# EAGLE design can_hub2 (EAGLE 9.6.2)
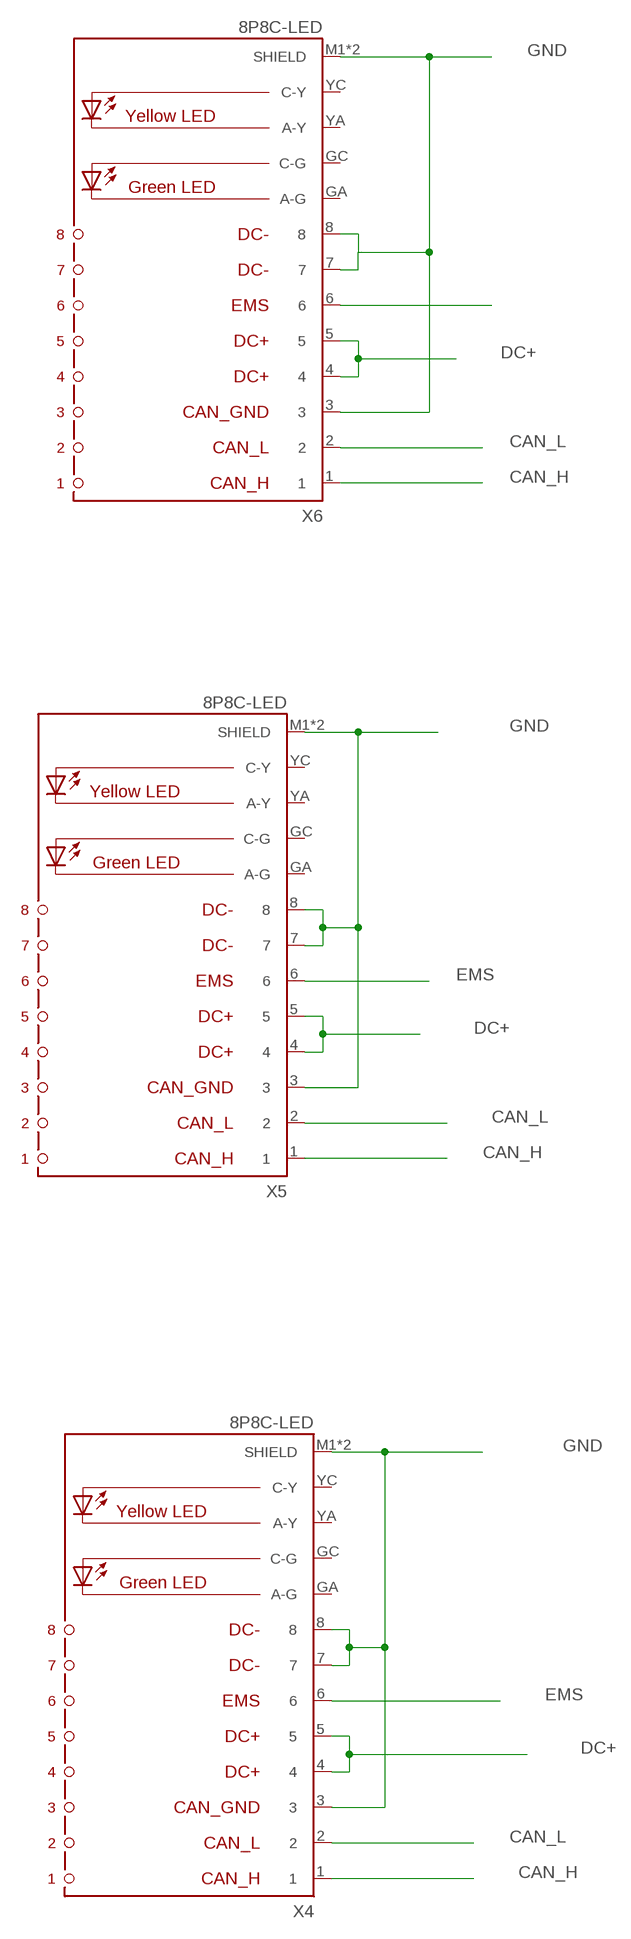
[diagram p0: schematic, sheet 1, part 1 of 3]
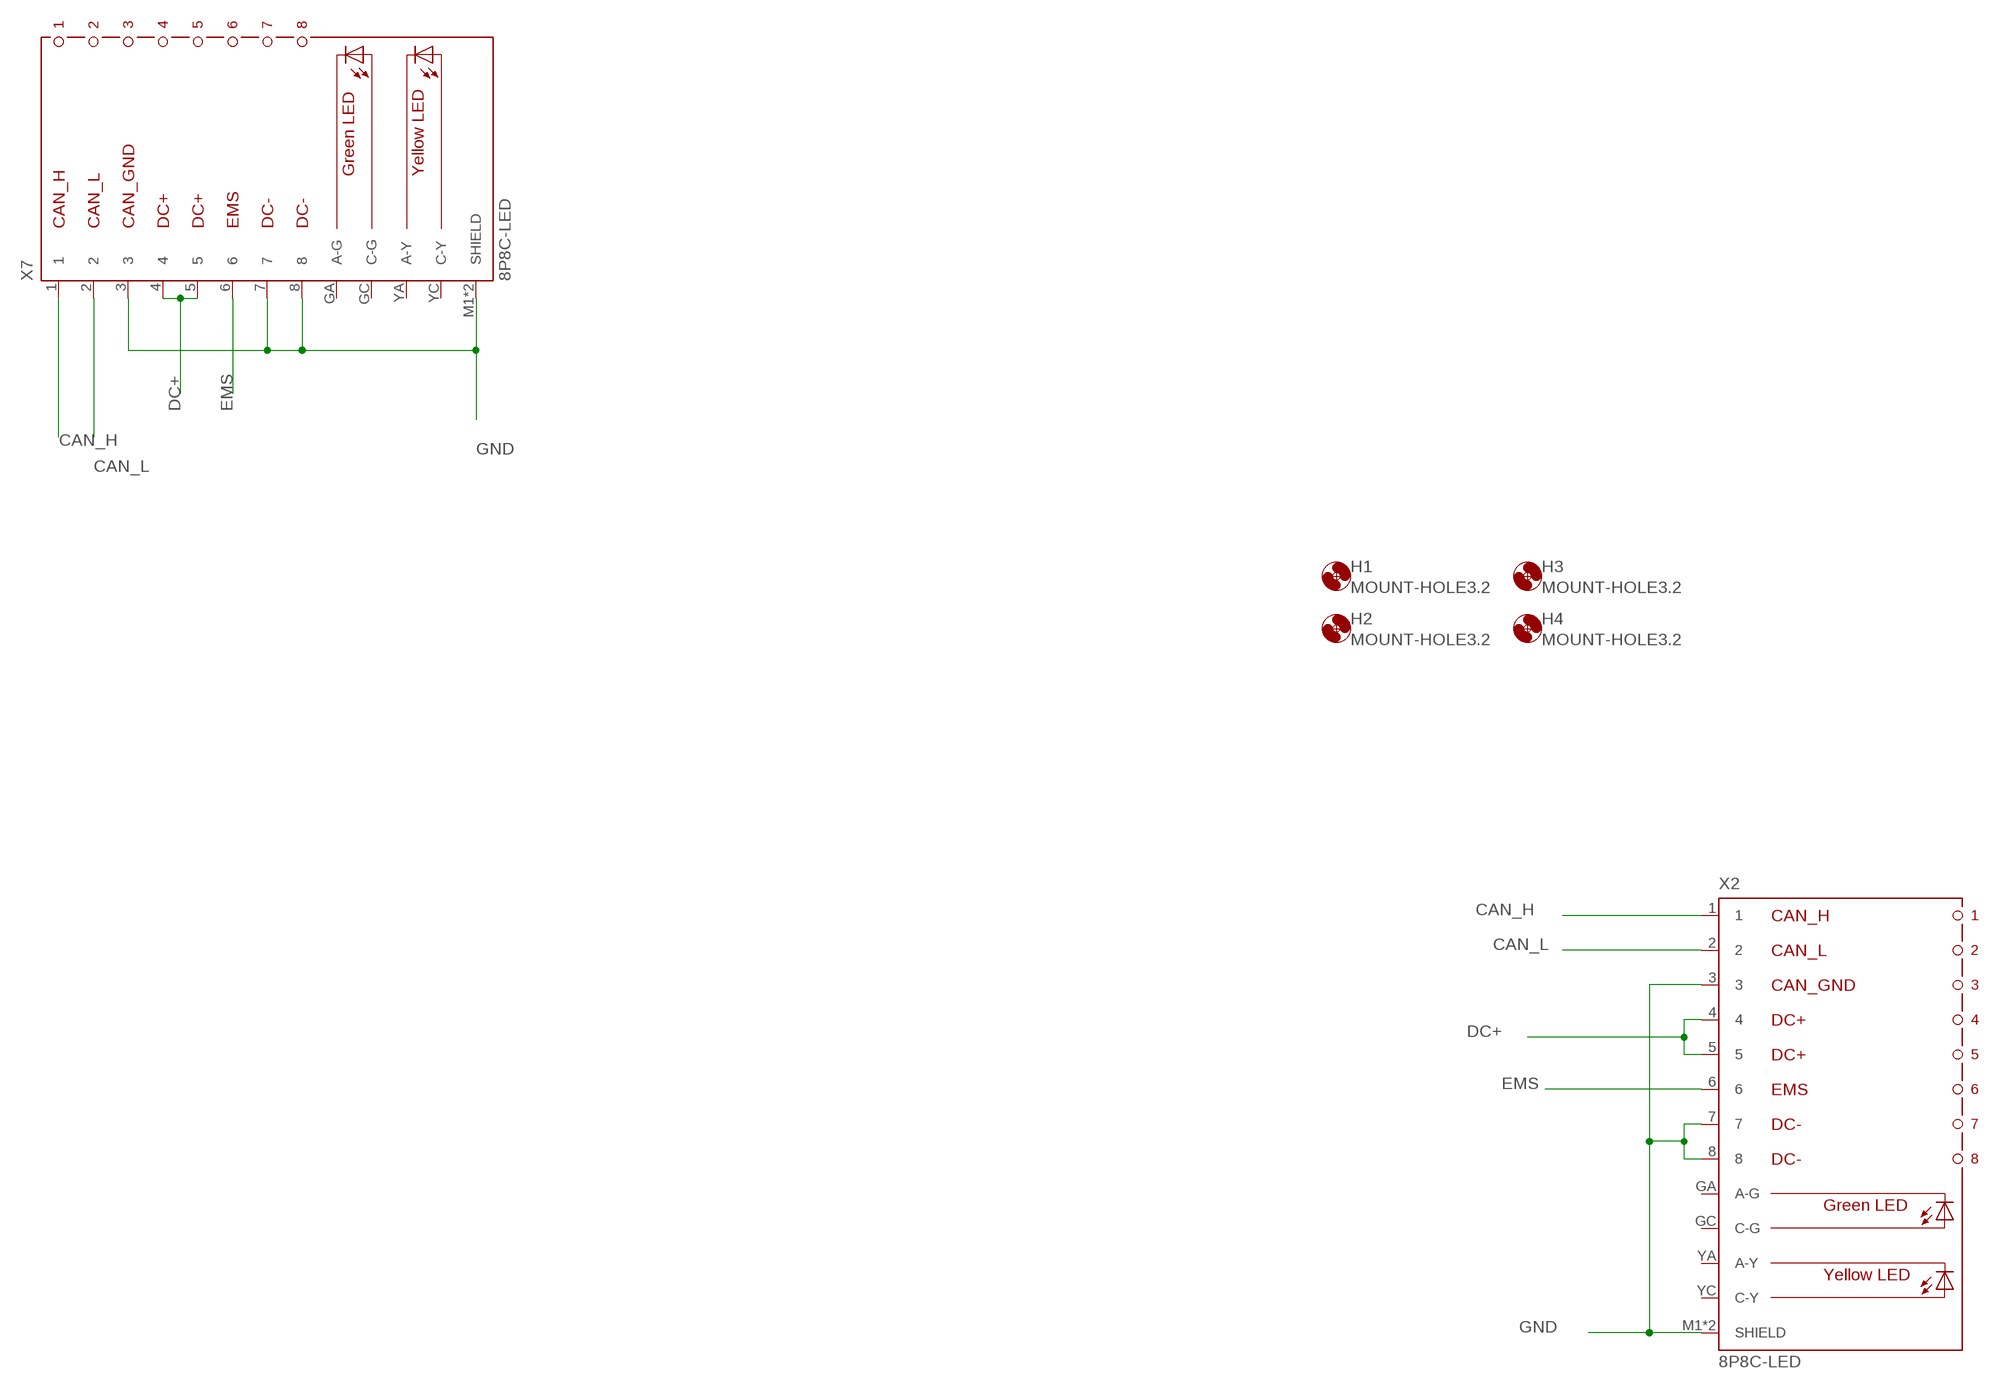
[diagram p1: schematic, sheet 1, part 2 of 3]
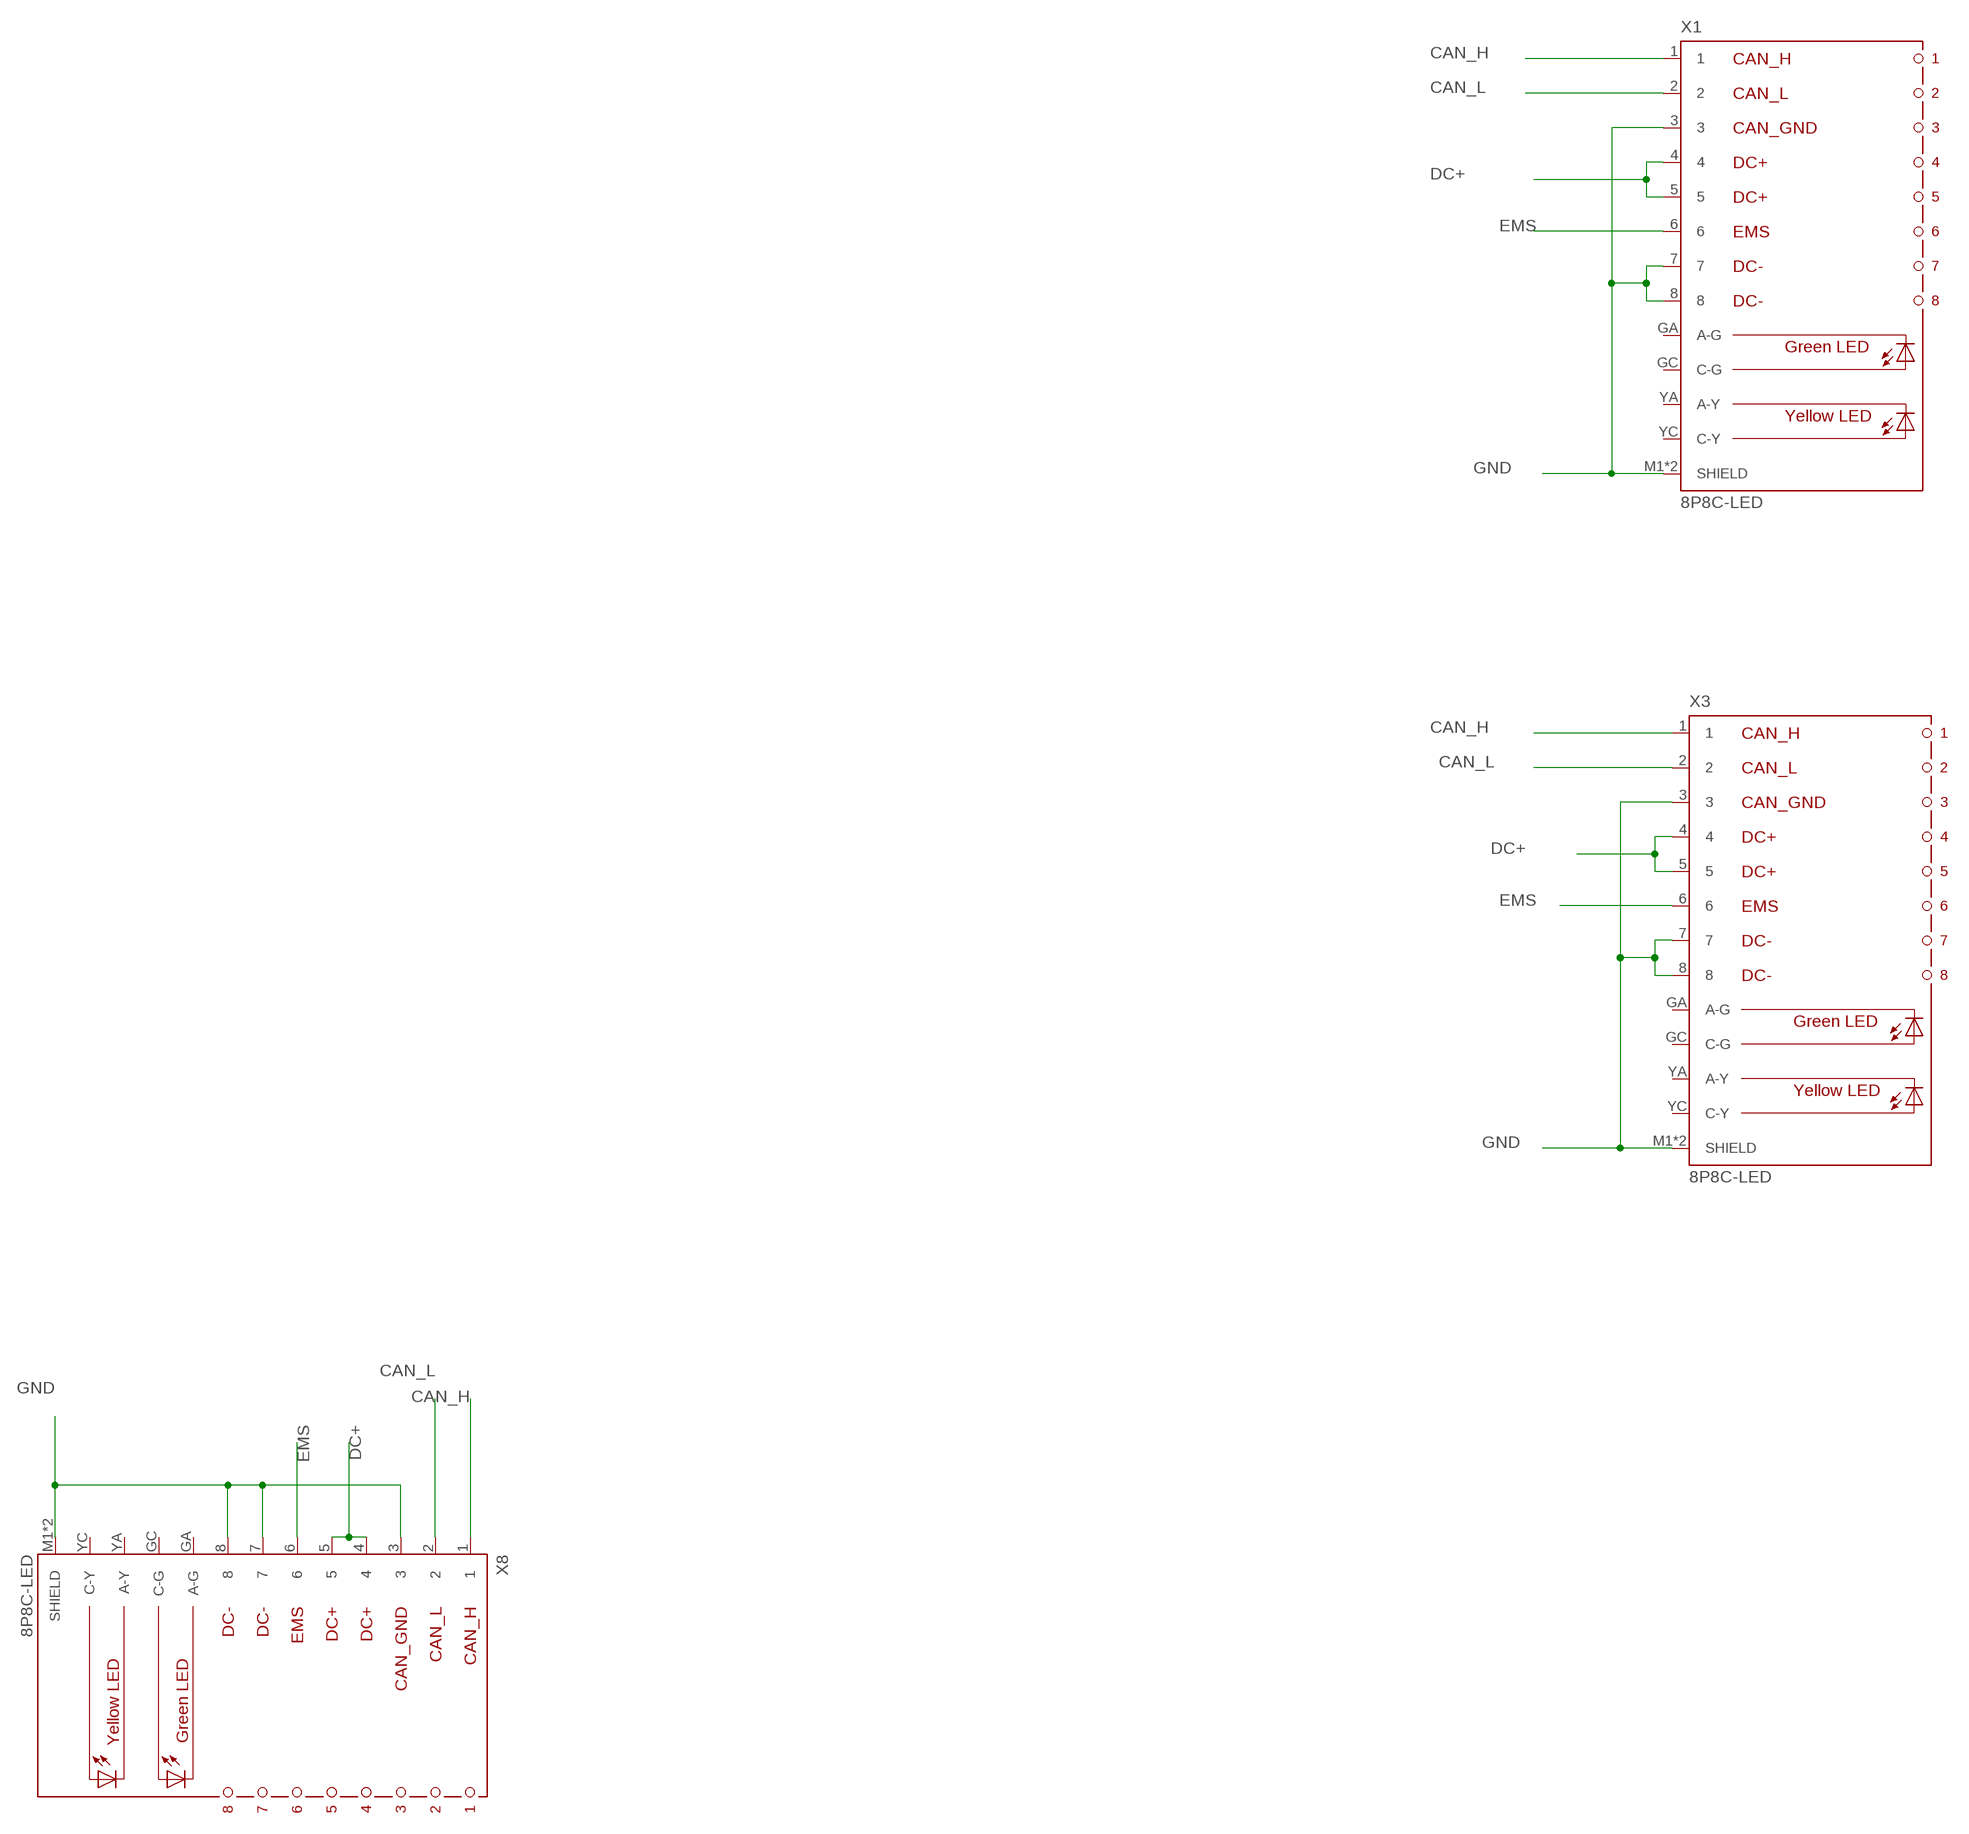
[diagram p2: schematic, sheet 1, part 3 of 3]

## Parts
H1  MOUNT-HOLE3.2  [3,2]
H2  MOUNT-HOLE3.2  [3,2]
H3  MOUNT-HOLE3.2  [3,2]
H4  MOUNT-HOLE3.2  [3,2]
X1  8P8C-LED  [8P8C-LED]
X2  8P8C-LED  [8P8C-LED]
X3  8P8C-LED  [8P8C-LED]
X4  8P8C-LED  [8P8C-LED]
X5  8P8C-LED  [8P8C-LED]
X6  8P8C-LED  [8P8C-LED]
X7  8P8C-LED  [8P8C-LED]
X8  8P8C-LED  [8P8C-LED]

## Nets
CAN_H: X1.1 X2.1 X3.1 X4.1 X5.1 X6.1 X7.1 X8.1
CAN_L: X1.2 X2.2 X3.2 X4.2 X5.2 X6.2 X7.2 X8.2
DC+: X1.4 X1.5 X2.4 X2.5 X3.4 X3.5 X4.4 X4.5 X5.4 X5.5 X6.4 X6.5 X7.4 X7.5 X8.4 X8.5
EMS: X1.6 X2.6 X3.6 X4.6 X5.6 X6.6 X7.6 X8.6
GND: X1.3 X1.7 X1.8 X1.M1(SHIELD) X1.M2(SHIELD) X2.3 X2.7 X2.8 X2.M1(SHIELD) X2.M2(SHIELD) X3.3 X3.7 X3.8 X3.M1(SHIELD) X3.M2(SHIELD) X4.3 X4.7 X4.8 X4.M1(SHIELD) X4.M2(SHIELD) X5.3 X5.7 X5.8 X5.M1(SHIELD) X5.M2(SHIELD) X6.3 X6.7 X6.8 X6.M1(SHIELD) X6.M2(SHIELD) X7.3 X7.7 X7.8 X7.M1(SHIELD) X7.M2(SHIELD) X8.3 X8.7 X8.8 X8.M1(SHIELD) X8.M2(SHIELD)
Unconnected: X1.GA(A-G) X1.GC(C-G) X1.YA(A-Y) X1.YC(C-Y) X2.GA(A-G) X2.GC(C-G) X2.YA(A-Y) X2.YC(C-Y) X3.GA(A-G) X3.GC(C-G) X3.YA(A-Y) X3.YC(C-Y) X4.GA(A-G) X4.GC(C-G) X4.YA(A-Y) X4.YC(C-Y) X5.GA(A-G) X5.GC(C-G) X5.YA(A-Y) X5.YC(C-Y) X6.GA(A-G) X6.GC(C-G) X6.YA(A-Y) X6.YC(C-Y) X7.GA(A-G) X7.GC(C-G) X7.YA(A-Y) X7.YC(C-Y) X8.GA(A-G) X8.GC(C-G) X8.YA(A-Y) X8.YC(C-Y)

## Library data of the parts
H1-H4 = holes:MOUNT-HOLE: MOUNTING HOLE with drill center marker
X1-X8 = con-rj45:8P8C-LED: generic 8P8C connector with two LED's; OC_FARNELL: unknown; OC_NEWARK: unknown

## Board
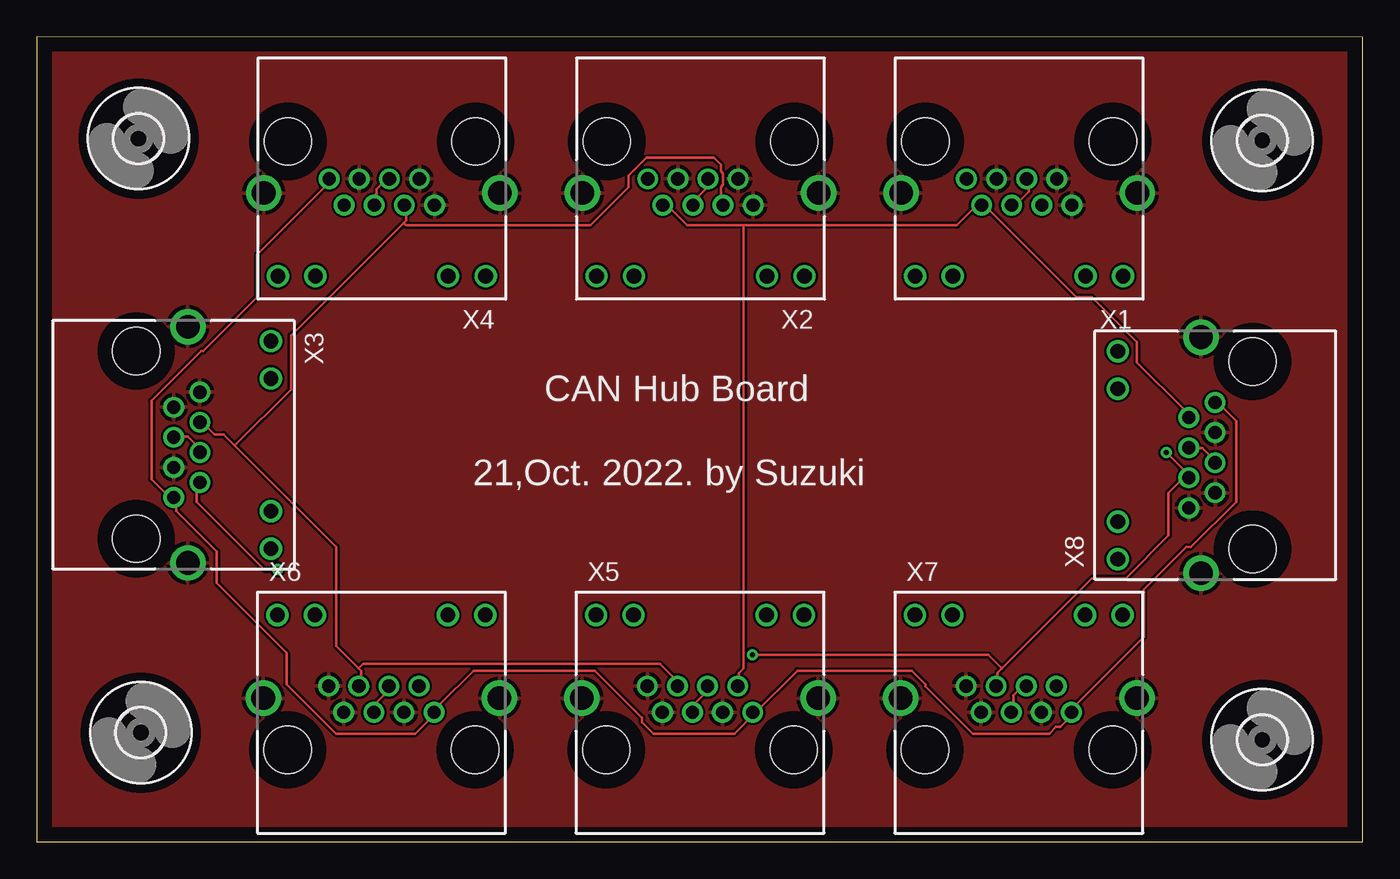
[diagram p3: board, top side]
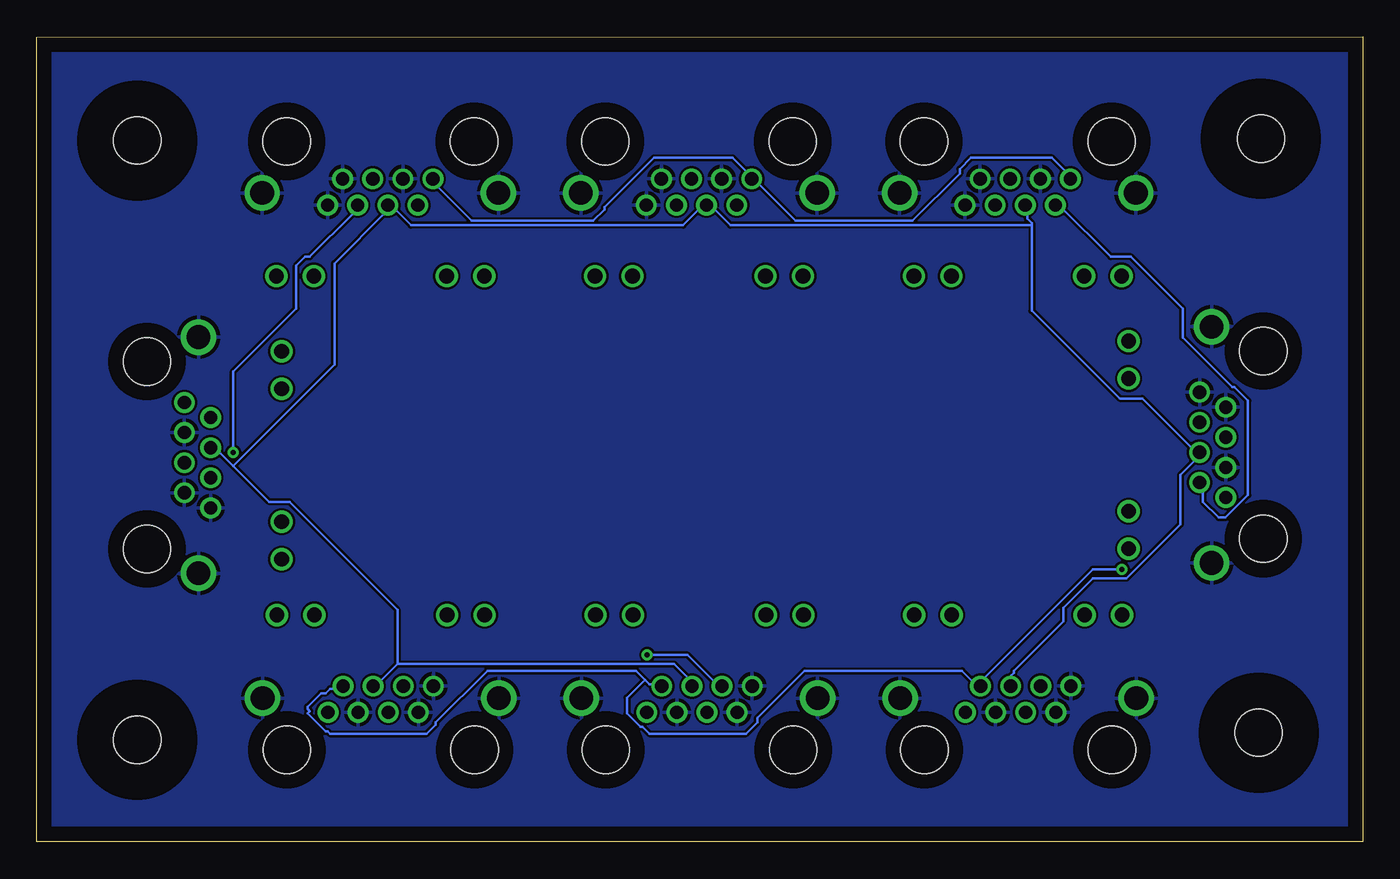
[diagram p4: board, bottom side, seen from below]

Size 89.8 x 54.53 mm. Coordinates in mm from the lower left corner, seen from the top.
Outline: 0,0.01 89.8,0 89.8,54.52 0,54.53 0,0.01
Copper layers (1*16): Top 0.035mm / dielectric 1.5mm / Bottom 0.035mm
Design rules "default": minimum track width 6mil, minimum drill 0.35mm, track to track 6mil, track to pad 6mil, pad to pad 6mil, via to via 6mil, smd to smd 6mil, copper to edge 40mil, drill to drill 6mil, minimum pad ring 10mil, minimum via ring 8mil, stop-mask expansion 4mil, vias tented up to drill 0mil, thermal gap 10mil

### Footprints (pad centres in the part's own frame; a part is rotated, then mirrored left to right if it is on the bottom)
3,2 = hole 3.2: 0,0
8P8C-LED = drill 0.9 pad 1.3: 1 3.57,-3.81; 2 2.55,-2.03; 3 1.53,-3.81; 4 0.51,-2.03; 5 -0.51,-3.81; 6 -1.53,-2.03; 7 -2.55,-3.81; 8 -3.57,-2.03 | drill 1 pad 1.422: GA 4.5,2.78; GC 7.04,2.78; YA -7.04,2.78; YC -4.5,2.78 | drill 1.6 pad 2.184: M1 -8,-2.85; M2 8,-2.85 | hole 3.2: 6.35,-6.35; -6.35,-6.35

### Placement (x,y rotation side)
H1  7.04,7.39 0 top
H2  6.88,47.64 0 top
H3  83,47.51 0 top
H4  83,6.91 0 top
X1  66.54,41.1 180 top
X2  44.95,41.1 180 top
X3  13.07,26.89 270 top
X4  23.36,41.1 180 top
X5  44.92,12.58 0 top
X6  23.33,12.58 0 top
X7  66.51,12.58 0 top
X8  76,26.19 90 top

### Tracks (layer width: path | path; a pad name or v marks a point on that pad's centre or on a via)
CAN_H
  Top 0.152: 48.62,8.7 47.24,7.33 41.76,7.33 41,8.09 41,8.39 37.8,11.59 29.57,11.59 27.28,9.31 27.28,9.15 26.98,8.85 X6.1 26.82,8.7 26.52,8.39 26.52,8.24 25.6,7.33 20.27,7.33 16.92,10.68 16.92,12.81 12.19,17.54 12.19,19.67 9.45,22.41 9.45,22.57 9.3,22.72 9.3,23.18 X3.1 9.14,23.33 8.84,23.63 8.69,23.63 7.77,24.55 7.77,29.88 11.12,33.23 11.28,33.23 14.94,36.89 14.94,39.79 19.66,44.51 19.66,44.82 X4.1 | 48.62,8.7 51.51,11.59 59.28,11.59 60.2,10.68 60.2,10.53 63.4,7.33 68.58,7.33 69.04,7.78 69.34,7.78 69.95,8.39 69.95,8.7 X7.1 69.95,8.85 74.98,13.88 74.98,17.08 77.88,19.97 78.18,19.97 81.23,23.02 81.23,28.51 80.31,29.42 80.16,29.42 79.86,29.73 X8.1 | 48.62,8.7 X5.1
  Bottom 0.152: X1.1 63.09,44.82 60.35,42.07 52.12,42.07 51.36,42.83 51.36,42.99 48.01,46.34 42.67,46.34 41.76,45.42 41.76,45.27 41.45,44.97 X2.1 41.3,44.82 41,44.51 40.84,44.51 38.41,42.07 30.48,42.07 27.28,45.27 27.28,45.58 26.52,46.34 21.03,46.34 19.66,44.97 X4.1
CAN_L  (via drill 0.35)
  Top 0.152: v16.31,18.45 15.39,18.45 10.82,23.02 10.82,24.09 10.97,24.24 X3.2 | X8.2 78.03,28.81 77.72,29.12 77.72,29.27 74.52,32.47 74.52,33.84 71.48,36.89 70.41,36.89 64.31,42.99 64.01,42.99 X1.2 63.86,42.99 63.55,42.99 62.33,41.77 47.85,41.77 | 47.85,41.77 44.04,41.77 42.82,42.99 42.52,42.99 X2.2 | 47.85,41.77 47.85,11.74 47.55,11.44 47.55,10.68 X5.2
  Bottom 0.152: v16.31,18.45 18.29,18.45 25.76,10.98 25.76,10.68 X6.2 25.91,10.68 26.21,10.68 27.13,11.59 37.8,11.59 41,8.39 41,8.09 41.76,7.33 48.31,7.33 48.77,7.78 48.92,7.78 49.84,8.7 49.84,9.76 48.62,10.98 | X4.2 20.73,42.99 20.42,42.99 17.07,39.63 15.7,39.63 12.19,36.13 12.19,34.15 8.84,30.8 8.69,30.8 7.77,29.88 7.77,23.48 9.3,21.96 9.75,21.96 10.82,23.02 10.82,24.09 10.97,24.24 X3.2 | 48.62,10.98 49.23,11.59 59.28,11.59 62.79,8.09 62.79,7.93 63.4,7.33 69.95,7.33 70.1,7.48 70.26,7.48 71.48,8.7 71.32,8.85 71.48,9 71.48,9.15 70.56,10.07 70.26,10.07 69.95,10.37 69.34,10.37 69.19,10.53 X7.2 | 48.62,10.98 48.31,10.68 47.55,10.68 X5.2
DC+
  Top 0.152: X1.4 66.14,43.14 66.45,43.44 66.6,43.44 67.21,44.05 67.21,44.66 67.06,44.82 X1.5 | X8.4 78.18,26.68 78.94,26.68 79.86,25.77 X8.5 | X5.5 44.5,8.85 44.5,9.31 45.41,10.22 45.41,10.53 X5.4 | X7.5 66.14,8.85 66.14,9.92 66.9,10.68 X7.4 | X2.4 44.5,43.14 44.5,43.44 45.41,44.36 45.41,44.82 X2.5 | X6.5 22.86,8.85 22.86,9.31 23.77,10.22 23.77,10.53 X6.4 | X3.5 9.3,27.44 10.21,27.44 11.12,26.53 X3.4 | X4.4 22.86,43.75 23.01,43.9 23.01,44.21 23.77,44.97 X4.5
  Bottom 0.152: 65.38,12.05 46.63,12.05 45.57,10.98 45.57,10.68 X5.4 | 65.38,12.05 66.9,10.53 X7.4 | 76.5,25.46 74.07,23.02 72.69,23.02 65.38,15.71 65.38,12.05 | 76.5,25.46 77.72,26.68 78.03,26.68 X8.4 | 76.5,25.46 69.65,32.32 69.65,39.18 66.14,42.68 66.14,42.99 X1.4 65.99,42.99 65.68,42.99 64.47,41.77 46.02,41.77 44.81,42.99 44.5,42.99 X2.4 44.35,42.99 44.04,42.99 42.82,41.77 22.4,41.77 | 22.4,41.77 22.4,41.92 22.71,42.23 22.71,42.99 X4.4 | 22.4,41.77 22.4,35.98 16.46,30.03 14.94,30.03 11.43,26.53 11.12,26.53 X3.4 11.12,26.38 11.12,26.07 12.34,24.85 12.34,21.5 16,17.84 18.29,17.84 20.27,15.86 20.27,14.95 23.62,11.59 23.62,11.44 23.77,11.29 23.77,10.68 X6.4
EMS  (via drill 0.35)
  Top 0.152: 65.38,11.74 71.48,17.84 73.76,17.84 76.66,20.74 76.66,23.63 77.57,24.55 78.03,24.55 X8.6 78.18,24.7 v76.5,26.38 | 65.38,11.74 65.08,11.44 65.08,10.68 X7.6 | 21.79,11.74 20.27,13.27 20.27,19.97 13.41,26.83 | 21.79,11.74 21.95,11.59 21.95,10.68 X6.6 | 13.41,26.83 12.65,27.59 12.04,27.59 11.12,28.51 X3.6 | 21.79,11.74 22.1,12.05 42.22,12.05 43.28,10.98 43.28,10.68 X5.6 | 24.84,41.92 17.22,34.3 17.22,30.64 13.41,26.83 | 24.84,41.92 24.99,42.07 24.99,42.99 X4.6 | 24.84,41.92 24.99,41.77 37.49,41.77 40.08,44.36 40.08,45.12 41.3,46.34 45.87,46.34 46.33,45.88 46.33,45.42 46.48,45.27 46.48,44.51 46.33,44.36 46.33,43.14 X2.6 | 65.38,11.74 64.47,12.66 v48.46,12.66
  Bottom 0.152: v76.5,26.38 76.5,31.86 72.24,36.13 72.24,39.02 71.63,39.63 71.32,39.63 68.43,42.53 68.43,42.68 68.12,42.99 X1.6 | v48.46,12.66 45.72,12.66 43.74,10.68 43.43,10.68 X5.6
GND
  pour Top: 0,54.51 0,0.01 89.8,0.01 89.8,54.51
  pour Bottom: 0,54.51 0,0.01 89.8,0.01 89.8,54.51

### Text on the board
tPlace: CAN Hub Board | 21,Oct. 2022. by Suzuki